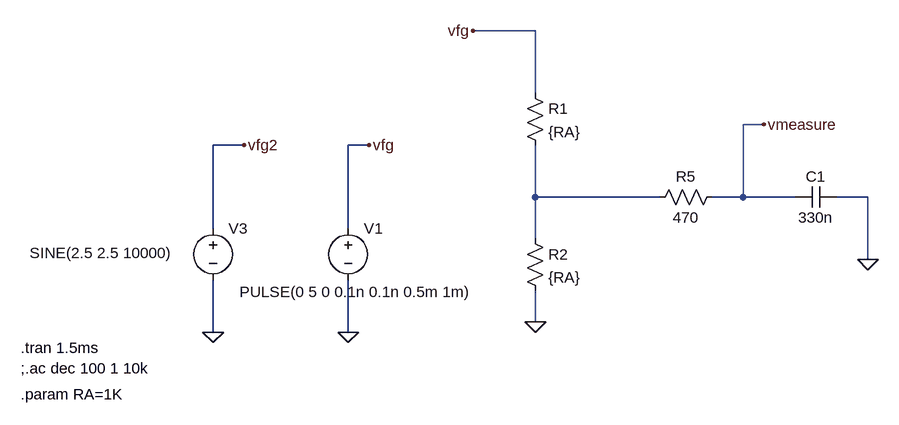
[diagram p0: schematic hardwaretask1schematic.asc]
hardwaretask1schematic.asc, the LTspice schematic file:
Version 4
SHEET 1 980 680
WIRE 448 -352 352 -352
WIRE 448 -256 448 -352
WIRE 800 -208 768 -208
WIRE 0 -176 -48 -176
WIRE 192 -176 160 -176
WIRE 448 -96 448 -176
WIRE 640 -96 448 -96
WIRE 768 -96 768 -208
WIRE 768 -96 720 -96
WIRE 848 -96 768 -96
WIRE 960 -96 912 -96
WIRE -48 -48 -48 -176
WIRE 160 -48 160 -176
WIRE 448 -32 448 -96
WIRE 960 0 960 -96
WIRE 448 96 448 48
WIRE -48 112 -48 32
WIRE 160 112 160 32
FLAG -48 112 0
FLAG 160 112 0
FLAG 960 0 0
FLAG 448 96 0
FLAG 192 -176 vfg
FLAG 0 -176 vfg2
FLAG 800 -208 vmeasure
FLAG 352 -352 vfg
SYMBOL voltage -48 -64 R0
WINDOW 3 -282 54 Left 2
WINDOW 123 0 0 Left 0
WINDOW 39 0 0 Left 0
SYMATTR InstName V3
SYMATTR Value SINE(2.5 2.5 10000)
SYMBOL voltage 160 -64 R0
WINDOW 3 -167 114 Left 2
WINDOW 123 0 0 Left 0
WINDOW 39 0 0 Left 0
SYMATTR InstName V1
SYMATTR Value PULSE(0 5 0 0.1n 0.1n 0.5m 1m)
SYMBOL res 432 -272 R0
SYMATTR InstName R1
SYMATTR Value {RA}
SYMBOL res 432 -48 R0
SYMATTR InstName R2
SYMATTR Value {RA}
SYMBOL res 736 -112 R90
WINDOW 0 0 56 VBottom 2
WINDOW 3 32 56 VTop 2
SYMATTR InstName R5
SYMATTR Value 470
SYMBOL cap 912 -112 R90
WINDOW 0 0 32 VBottom 2
WINDOW 3 32 32 VTop 2
SYMATTR InstName C1
SYMATTR Value 330n
TEXT -344 136 Left 2 !.tran 1.5ms
TEXT -344 168 Left 2 !;.ac dec 100 1 10k
TEXT -344 208 Left 2 !.param RA=1K

The netlist it stands for:
* hardwaretask1schematic.asc
V3 vfg2 0 SINE(2.5 2.5 10000)
V1 vfg 0 PULSE(0 5 0 0.1n 0.1n 0.5m 1m)
R1 vfg N001 {RA}
R2 N001 0 {RA}
R5 vmeasure N001 470
C1 0 vmeasure 330n
.tran 1.5ms
;.ac dec 100 1 10k
.param RA=1K
.backanno
.end